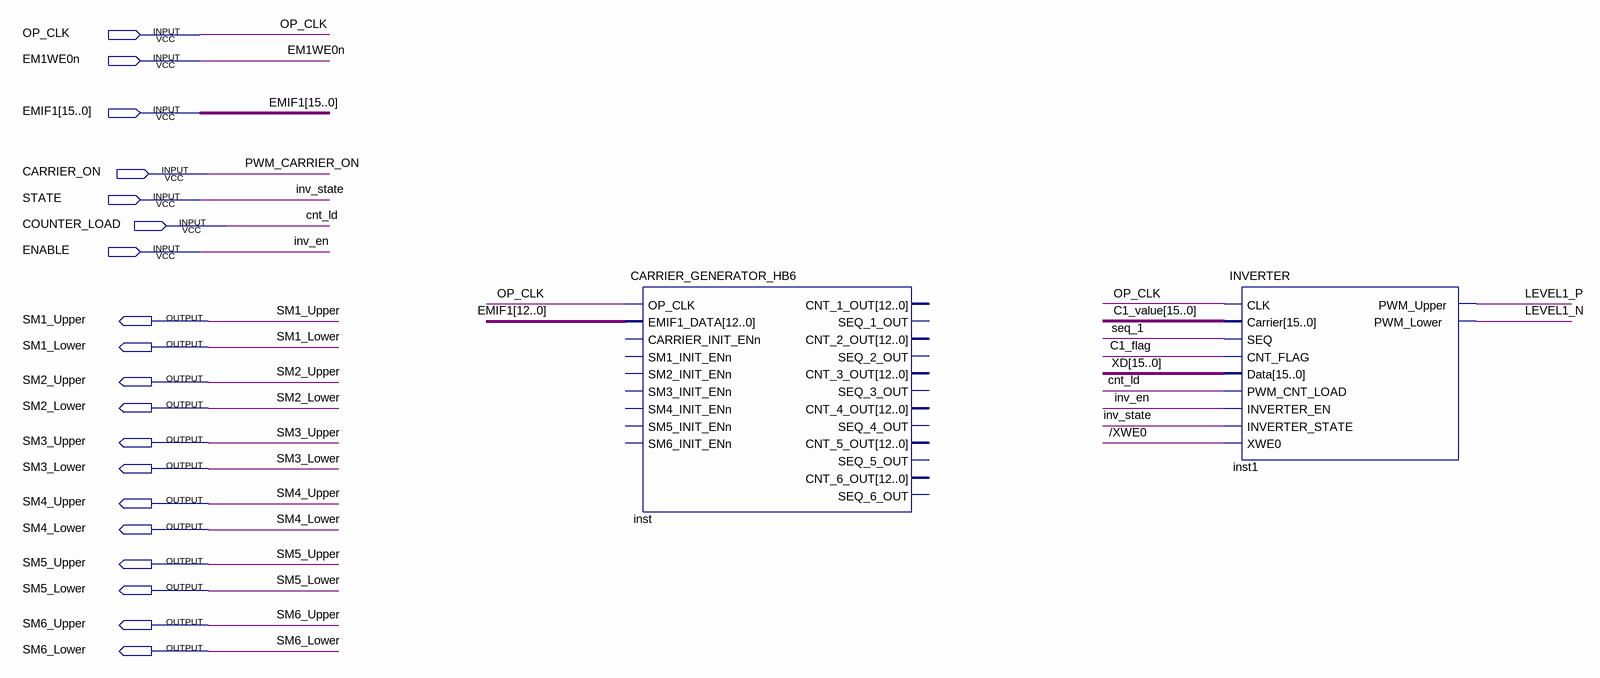
[diagram p0: schematic sheet]
// Quartus schematic HALF_BRIDGE_GATING.bdf as structural Verilog: 2 symbols, 19 pins
module HALF_BRIDGE_GATING (
  input  OP_CLK,
  input  EM1WE0n,
  input  [15:0] EMIF1,
  input  CARRIER_ON,
  input  STATE,
  input  COUNTER_LOAD,
  input  ENABLE,
  output SM1_Upper,
  output SM1_Lower,
  output SM2_Upper,
  output SM2_Lower,
  output SM3_Upper,
  output SM3_Lower,
  output SM4_Upper,
  output SM4_Lower,
  output SM5_Upper,
  output SM5_Lower,
  output SM6_Upper,
  output SM6_Lower
);

  wire \/XWE0 , C1_flag, LEVEL1_N, LEVEL1_P, seq_1;
  wire [15:0] C1_value, XD;

  CARRIER_GENERATOR_HB6 inst (
    .OP_CLK(OP_CLK), .EMIF1_DATA(EMIF1[12:0]));  // open: CARRIER_INIT_ENn, SM1_INIT_ENn, SM2_INIT_ENn, SM3_INIT_ENn, SM4_INIT_ENn, SM5_INIT_ENn, SM6_INIT_ENn, CNT_1_OUT, SEQ_1_OUT, CNT_2_OUT, SEQ_2_OUT, CNT_3_OUT, SEQ_3_OUT, CNT_4_OUT, SEQ_4_OUT, CNT_5_OUT, SEQ_5_OUT, CNT_6_OUT, SEQ_6_OUT
  INVERTER inst1 (
    .CLK(OP_CLK), .Carrier(C1_value), .SEQ(seq_1), .CNT_FLAG(C1_flag), .Data(XD),
    .PWM_CNT_LOAD(COUNTER_LOAD), .INVERTER_EN(ENABLE), .INVERTER_STATE(STATE), .XWE0(\/XWE0 ),
    .PWM_Upper(LEVEL1_P), .PWM_Lower(LEVEL1_N));

  // Other names for the same wires on the sheet: cnt_ld = COUNTER_LOAD; inv_en = ENABLE; inv_state = STATE;
  //   PWM_CARRIER_ON = CARRIER_ON
endmodule
